# EAGLE design intel-edison-pin-breakout (EAGLE 7.3.0)
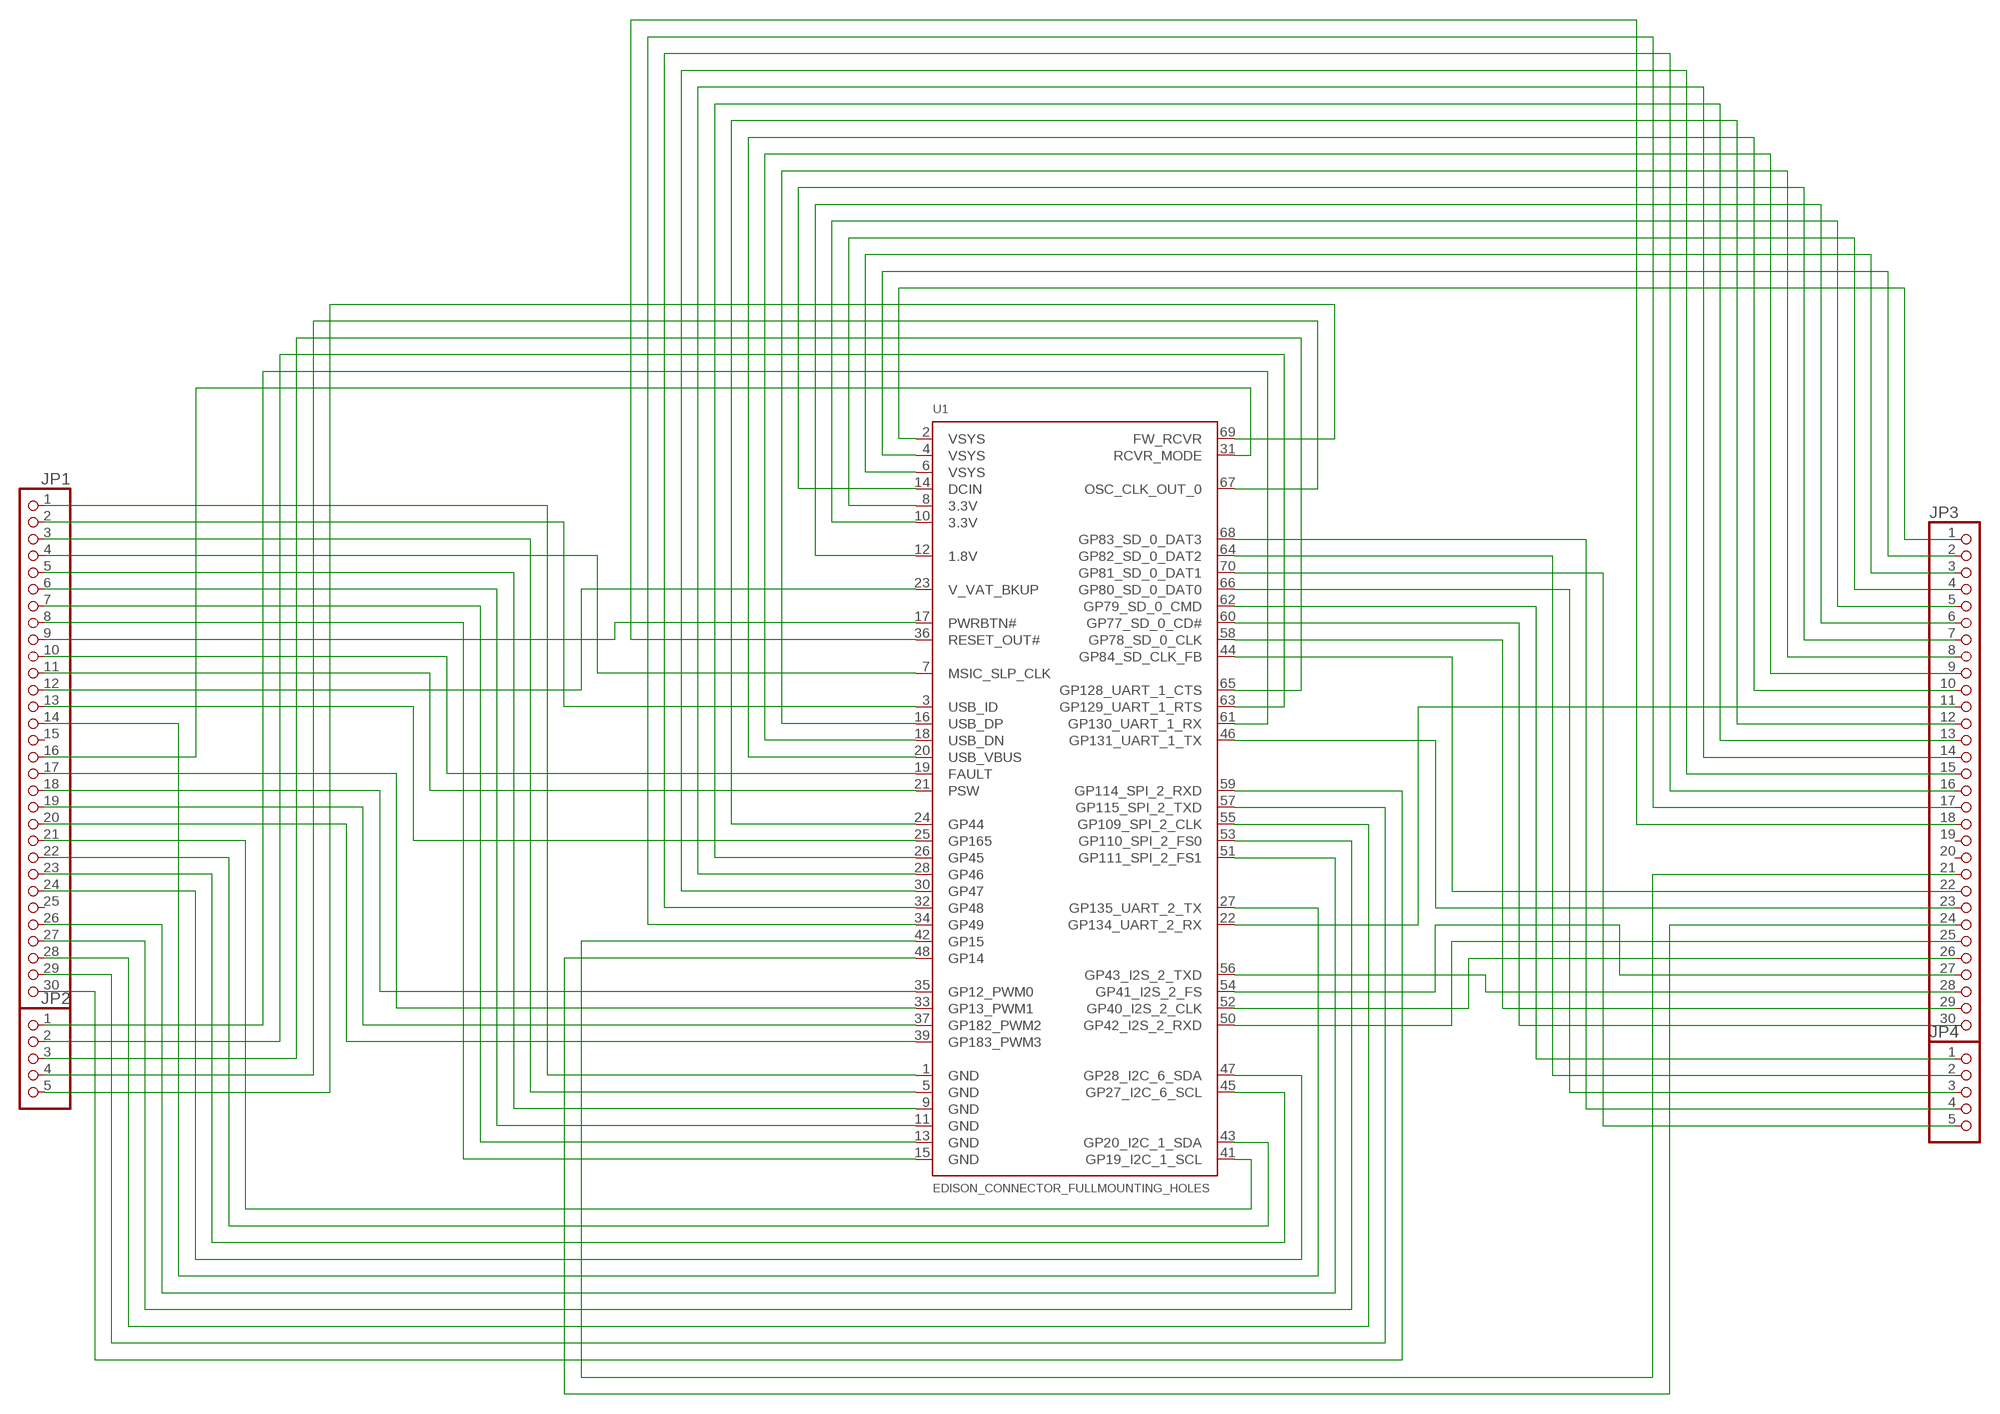
[diagram p0: schematic, sheet 1]

## Parts
JP1  PINHD-1X30  [1X30]
JP2  PINHD-1X5  [1X05]
JP3  PINHD-1X30  [1X30]
JP4  PINHD-1X5  [1X05]
U1  EDISON_CONNECTOR_FULLMOUNTING_HOLES  [EDISON_DAUGHTER]

## Nets
N$1: JP1.1 U1.1(GND)
N$2: JP1.2 U1.3(USB_ID)
N$3: JP1.3 U1.5(GND)
N$4: JP1.4 U1.7(MSIC_SLP_CLK)
N$5: JP1.5 U1.9(GND)
N$6: JP1.6 U1.11(GND)
N$7: JP1.7 U1.13(GND)
N$8: JP1.8 U1.15(GND)
N$9: JP1.9 U1.17(PWRBTN#)
N$10: JP1.10 U1.19(FAULT)
N$11: JP1.11 U1.21(PSW)
N$12: JP1.12 U1.23(V_VAT_BKUP)
N$13: JP1.13 U1.25(GP165)
N$14: JP1.17 U1.33(GP13_PWM1)
N$15: JP1.16 U1.31(RCVR_MODE)
N$16: JP1.18 U1.35(GP12_PWM0)
N$17: JP1.19 U1.37(GP182_PWM2)
N$18: JP1.20 U1.39(GP183_PWM3)
N$19: JP1.21 U1.41(GP19_I2C_1_SCL)
N$20: JP1.22 U1.43(GP20_I2C_1_SDA)
N$21: JP1.23 U1.45(GP27_I2C_6_SCL)
N$22: JP1.24 U1.47(GP28_I2C_6_SDA)
N$23: JP1.26 U1.51(GP111_SPI_2_FS1)
N$24: JP1.27 U1.53(GP110_SPI_2_FS0)
N$25: JP1.28 U1.55(GP109_SPI_2_CLK)
N$26: JP1.29 U1.57(GP115_SPI_2_TXD)
N$27: JP1.30 U1.59(GP114_SPI_2_RXD)
N$28: JP1.14 U1.27(GP135_UART_2_TX)
N$29: JP2.1 U1.61(GP130_UART_1_RX)
N$30: JP2.2 U1.63(GP129_UART_1_RTS)
N$31: JP2.3 U1.65(GP128_UART_1_CTS)
N$32: JP2.4 U1.67(OSC_CLK_OUT_0)
N$33: JP2.5 U1.69(FW_RCVR)
N$34: JP3.1 U1.2(VSYS)
N$35: JP3.2 U1.4(VSYS)
N$36: JP3.3 U1.6(VSYS)
N$37: JP3.4 U1.8(3.3V)
N$38: JP3.5 U1.10(3.3V)
N$39: JP3.6 U1.12(1.8V)
N$40: JP3.7 U1.14(DCIN)
N$41: JP3.8 U1.16(USB_DP)
N$42: JP3.9 U1.18(USB_DN)
N$43: JP3.10 U1.20(USB_VBUS)
N$44: JP3.18 U1.36(RESET_OUT#)
N$45: JP3.12 U1.24(GP44)
N$46: JP3.13 U1.26(GP45)
N$47: JP3.14 U1.28(GP46)
N$48: JP3.15 U1.30(GP47)
N$49: JP3.16 U1.32(GP48)
N$50: JP3.17 U1.34(GP49)
N$51: JP3.11 U1.22(GP134_UART_2_RX)
N$52: JP3.21 U1.42(GP15)
N$53: JP4.5 U1.70(GP81_SD_0_DAT1)
N$54: JP4.4 U1.68(GP83_SD_0_DAT3)
N$55: JP3.24 U1.48(GP14)
N$56: JP4.3 U1.66(GP80_SD_0_DAT0)
N$57: JP4.2 U1.64(GP82_SD_0_DAT2)
N$58: JP4.1 U1.62(GP79_SD_0_CMD)
N$59: JP3.30 U1.60(GP77_SD_0_CD#)
N$60: JP3.29 U1.58(GP78_SD_0_CLK)
N$61: JP3.27 U1.54(GP41_I2S_2_FS)
N$62: JP3.23 U1.46(GP131_UART_1_TX)
N$63: JP3.26 U1.52(GP40_I2S_2_CLK)
N$64: JP3.25 U1.50(GP42_I2S_2_RXD)
N$65: JP3.22 U1.44(GP84_SD_CLK_FB)
N$66: JP3.28 U1.56(GP43_I2S_2_TXD)
Unconnected: JP1.15 JP1.25 JP3.19 JP3.20

## Library data of the parts
JP1 JP3 = pinhead:PINHD-1X30: PIN HEADER
JP2 JP4 = pinhead:PINHD-1X5: PIN HEADER
U1 = Edison:EDISON_CONNECTOR_FULL

## Board
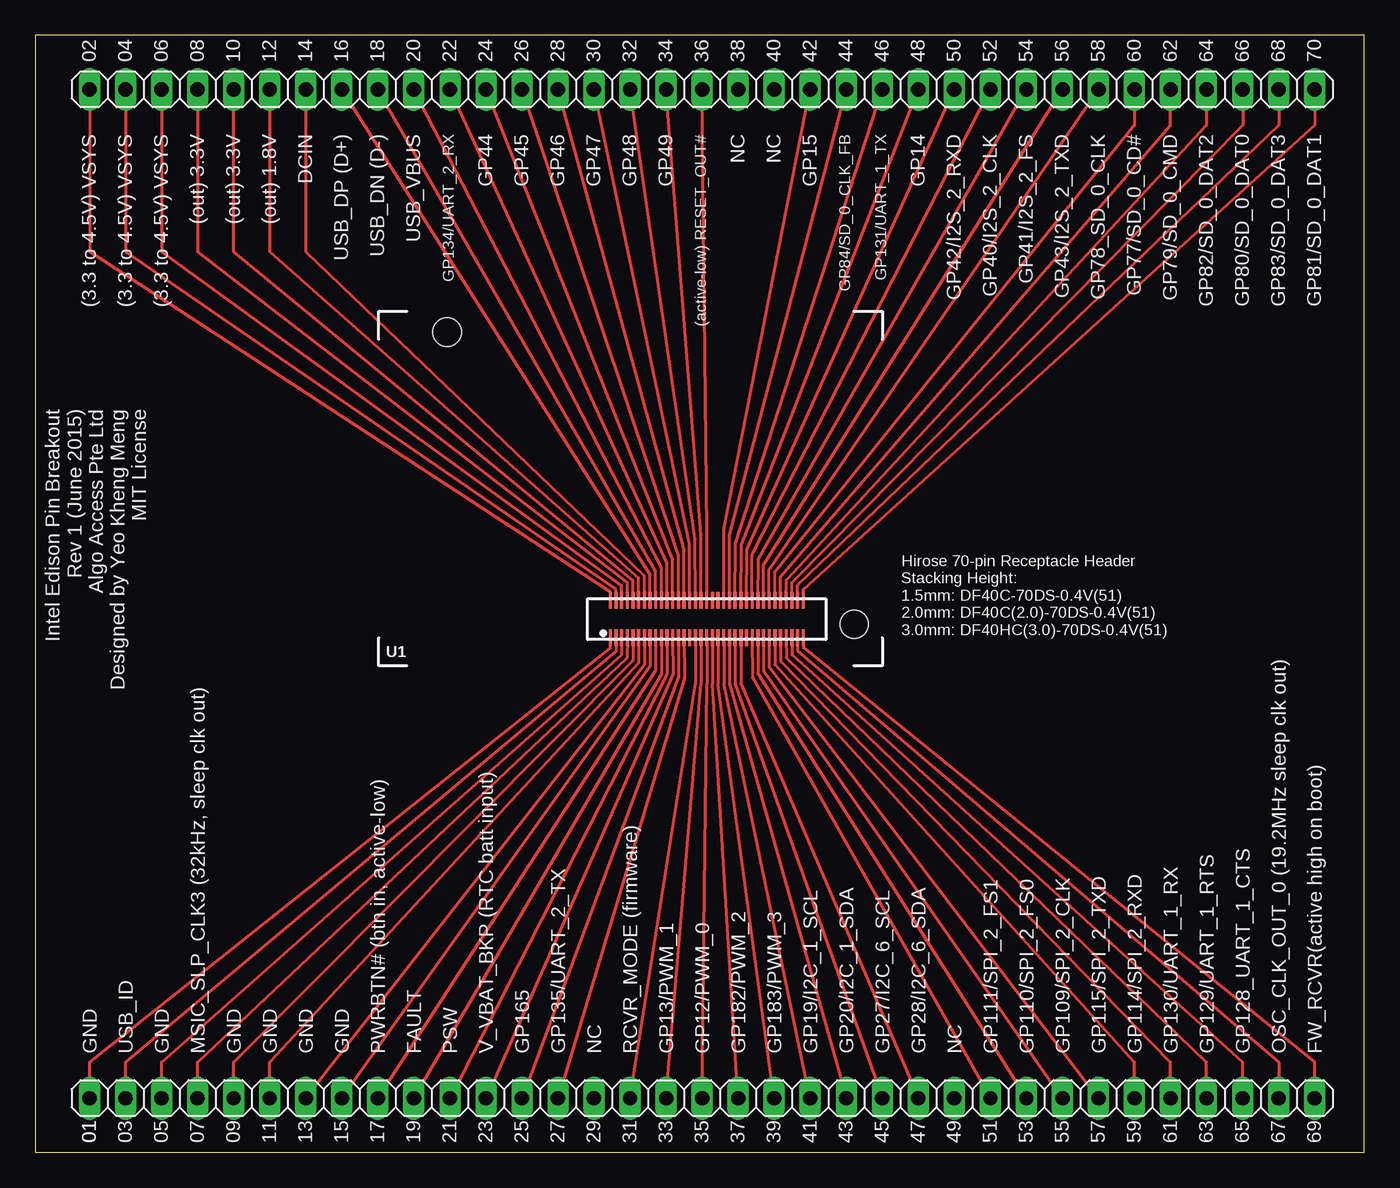
[diagram p1: board, top side]

Size 93.65 x 78.73 mm. Coordinates in mm from the lower left corner, seen from the top.
Outline: 0,0 93.65,0 93.65,78.73 0,78.73 0,0
Copper layers (1*16): Top 0.035mm / dielectric 1.5mm / Bottom 0.035mm
Design rules "SeeedStudio_2layer_DRU_no_angle_20140221": minimum track width 6mil, minimum drill 12mil, track to track 6mil, track to pad 6mil, pad to pad 6mil, via to via 6mil, smd to smd 0mil, copper to edge 10mil, drill to drill 10mil, minimum pad ring 10mil, minimum via ring 6mil, stop-mask expansion 2mil, vias tented up to drill 100mil, thermal gap 10mil

### Footprints (pad centres in the part's own frame; a part is rotated, then mirrored left to right if it is on the bottom)
1X30 = drill 1.016 long: 1 -36.83,0; 2 -34.29,0; 3 -31.75,0; 4 -29.21,0; 5 -26.67,0; 6 -24.13,0; 7 -21.59,0; 8 -19.05,0; 9 -16.51,0; 10 -13.97,0; 11 -11.43,0; 12 -8.89,0; 13 -6.35,0; 14 -3.81,0; 15 -1.27,0; 16 1.27,0; 17 3.81,0; 18 6.35,0; 19 8.89,0; 20 11.43,0; 21 13.97,0; 22 16.51,0; 23 19.05,0; 24 21.59,0; 25 24.13,0; 26 26.67,0; 27 29.21,0; 28 31.75,0; 29 34.29,0; 30 36.83,0
1X05 = drill 1.016 long: 1 -5.08,0; 2 -2.54,0; 3 0,0; 4 2.54,0; 5 5.08,0
EDISON_DAUGHTER = smd 1.14 x 0.2: 1 1.98,19.17; 2 4.62,19.17; 3 1.98,18.77; 4 4.62,18.77; 5 1.98,18.37; 6 4.62,18.37; 7 1.98,17.97; 8 4.62,17.97; 9 1.98,17.57; 10 4.62,17.57; 11 1.98,17.17; 12 4.62,17.17; 13 1.98,16.77; 14 4.62,16.77; 15 1.98,16.37; 16 4.62,16.37; 17 1.98,15.97; 18 4.62,15.97; 19 1.98,15.57; 20 4.62,15.57; 21 1.98,15.17; 22 4.62,15.17; 23 1.98,14.77; 24 4.62,14.77; 25 1.98,14.37; 26 4.62,14.37; 27 1.98,13.97; 28 4.62,13.97; 29 1.98,13.57; 30 4.62,13.57; 31 1.98,13.17; 32 4.62,13.17; 33 1.98,12.77; 34 4.62,12.77; 35 1.98,12.37; 36 4.62,12.37; 37 1.98,11.97; 38 4.62,11.97; 39 1.98,11.57; 40 4.62,11.57; 41 1.98,11.17; 42 4.62,11.17; 43 1.98,10.77; 44 4.62,10.77; 45 1.98,10.37; 46 4.62,10.37; 47 1.98,9.97; 48 4.62,9.97; 49 1.98,9.57; 50 4.62,9.57; 51 1.98,9.17; 52 4.62,9.17; 53 1.98,8.77; 54 4.62,8.77; 55 1.98,8.37; 56 4.62,8.37; 57 1.98,7.97; 58 4.62,7.97; 59 1.98,7.57; 60 4.62,7.57; 61 1.98,7.17; 62 4.62,7.17; 63 1.98,6.77; 64 4.62,6.77; 65 1.98,6.37; 66 4.62,6.37; 67 1.98,5.97; 68 4.62,5.97; 69 1.98,5.57; 70 4.62,5.57 | hole 2: 23.53,30.67; 2.93,1.98

### Placement (x,y rotation side)
JP1  40.64,3.81 0 top
JP2  85.09,3.81 0 top
JP3  40.64,74.93 0 top
JP4  85.09,74.93 0 top
U1  59.69,34.29 90 top

### Tracks (layer width: path | path; a pad name or v marks a point on that pad's centre or on a via)
N$1
  Top 0.203: U1.1 40.52,35.52 3.81,6.35 JP1.1
N$2
  Top 0.203: U1.3 40.92,35.3 6.35,6.35 JP1.2
N$3
  Top 0.203: U1.5 41.32,35.06 8.89,6.35 JP1.3
N$4
  Top 0.203: U1.7 41.71,34.85 11.43,6.35 JP1.4
N$5
  Top 0.203: U1.9 42.11,34.67 13.97,6.35 JP1.5
N$6
  Top 0.203: JP1.6 16.51,6.35 42.5,34.51 U1.11
N$7
  Top 0.203: U1.13 42.93,34.37 JP1.7
N$8
  Top 0.203: U1.15 43.33,34.27 JP1.8
N$9
  Top 0.203: U1.17 43.71,33.96 JP1.9
N$10
  Top 0.203: U1.19 44.12,33.71 JP1.10
N$11
  Top 0.203: U1.21 44.53,33.71 JP1.11
N$12
  Top 0.203: U1.23 44.93,33.71 JP1.12
N$13
  Top 0.203: U1.25 45.31,33.53 JP1.13
N$14
  Top 0.203: U1.33 46.92,33.02 JP1.17
N$15
  Top 0.203: U1.31 46.52,33.02 JP1.16
N$16
  Top 0.203: U1.35 47.32,33.02 JP1.18
N$17
  Top 0.203: U1.37 47.72,33.02 JP1.19
N$18
  Top 0.203: U1.39 48.12,33.02 JP1.20
N$19
  Top 0.203: U1.41 48.52,33.02 JP1.21
N$20
  Top 0.203: U1.43 48.92,33.02 JP1.22
N$21
  Top 0.203: U1.45 49.32,33.02 JP1.23
N$22
  Top 0.203: U1.47 49.72,33.02 JP1.24
N$23
  Top 0.203: U1.51 50.52,33.46 JP1.26
N$24
  Top 0.203: U1.53 50.92,33.74 JP1.27
N$25
  Top 0.203: U1.55 51.32,33.97 JP1.28
N$26
  Top 0.203: U1.57 51.72,34.24 JP1.29
N$27
  Top 0.203: U1.59 52.12,34.37 77.47,6.35 JP1.30
N$28
  Top 0.203: U1.27 45.74,33.45 JP1.14
N$29
  Top 0.203: U1.61 52.52,34.62 80.01,6.35 JP2.1
N$30
  Top 0.203: U1.63 52.92,34.85 82.55,6.35 JP2.2
N$31
  Top 0.203: JP2.3 85.09,6.35 53.32,35.08 U1.65
N$32
  Top 0.203: U1.67 53.72,35.35 87.63,6.35 JP2.4
N$33
  Top 0.203: U1.69 54.12,35.57 90.17,6.35 JP2.5
N$34
  Top 0.203: U1.2 40.52,39.51 3.81,63.5 JP3.1
N$35
  Top 0.203: JP3.2 6.35,63.5 40.92,39.7 U1.4
N$36
  Top 0.203: JP3.3 8.89,63.5 41.32,39.95 U1.6
N$37
  Top 0.203: JP3.4 11.43,63.5 41.73,40.17 U1.8
N$38
  Top 0.203: U1.10 42.12,40.33 13.97,63.5 JP3.5
N$39
  Top 0.203: U1.12 42.52,40.49 16.51,63.5 JP3.6
N$40
  Top 0.203: U1.14 42.92,40.63 19.05,63.5 JP3.7
N$41
  Top 0.203: U1.16 43.33,40.74 JP3.8
N$42
  Top 0.203: U1.18 43.71,40.97 JP3.9
N$43
  Top 0.203: U1.20 44.12,41.22 JP3.10
N$44
  Top 0.203: U1.36 47.32,43.76 JP3.18
N$45
  Top 0.203: U1.24 44.91,41.81 JP3.12
N$46
  Top 0.203: U1.26 45.34,42.06 JP3.13
N$47
  Top 0.203: U1.28 45.72,42.52 JP3.14
N$48
  Top 0.203: U1.30 46.1,42.88 JP3.15
N$49
  Top 0.203: U1.32 46.51,43.26 JP3.16
N$50
  Top 0.203: U1.34 46.91,43.51 JP3.17
N$51
  Top 0.203: U1.22 44.53,41.53 JP3.11
N$52
  Top 0.203: U1.42 48.54,43.97 JP3.21
N$53
  Top 0.203: U1.70 54.12,39.67 54.13,39.67 90.17,72.39 JP4.5
N$54
  Top 0.203: U1.68 53.72,39.98 87.63,72.39 JP4.4
N$55
  Top 0.203: U1.48 49.76,42.8 JP3.24
N$56
  Top 0.203: U1.66 53.31,40.16 85.09,72.39 JP4.3
N$57
  Top 0.203: U1.64 52.93,40.36 82.55,72.39 JP4.2
N$58
  Top 0.203: U1.62 52.53,40.59 80.01,72.39 JP4.1
N$59
  Top 0.203: U1.60 52.12,40.92 77.47,72.39 JP3.30
N$60
  Top 0.203: U1.58 51.71,41.1 JP3.29
N$61
  Top 0.203: U1.54 50.95,41.83 JP3.27
N$62
  Top 0.203: U1.46 49.33,42.93 JP3.23
N$63
  Top 0.203: U1.52 50.49,42.09 JP3.26
N$64
  Top 0.203: U1.50 50.14,42.49 JP3.25
N$65
  Top 0.203: U1.44 48.92,43.48 JP3.22
N$66
  Top 0.203: U1.56 51.31,41.4 JP3.28

### Text on the board
tPlace: 02 | 04 | 06 | 08 | 10 | 12 | 14 | 16 | 18 | 20 | 22 | 24 | 26 | 28 | 30 | 32 | 34 | 36 | 38 | 40 | 42 | 44 | 46 | 48 | 50 | 52 | 54 | 56 | 58 | 60 | 62 | 64 | 66 | 68 | 70 | (3.3 to 4.5V) VSYS | (3.3 to 4.5V) VSYS | (3.3 to 4.5V) VSYS | (out) 3.3V | (out) 3.3V | (out) 1.8V | DCIN | USB_DP (D+) | USB_DN (D-) | USB_VBUS | GP134/UART_2_RX | GP44 | GP45 | GP46 | GP47 | GP48 | GP49 | (active-low) RESET_OUT# | NC | NC | GP15 | GP84/SD_0_CLK_FB | GP131/UART_1_TX | GP14 | GP42/I2S_2_RXD | GP40/I2S_2_CLK | GP41/I2S_2_FS | GP43/I2S_2_TXD | GP78_SD_0_CLK | GP77/SD_0_CD# | GP79/SD_0_CMD | GP82/SD_0_DAT2 | GP80/SD_0_DAT0 | GP83/SD_0_DAT3 | GP81/SD_0_DAT1 | Intel Edison Pin Breakout / Rev 1 (June 2015) / Algo Access Pte Ltd / Designed by Yeo Kheng Meng / MIT License | Hirose 70-pin Receptacle Header / Stacking Height: / 1.5mm: DF40C-70DS-0.4V(51) / 2.0mm: DF40C(2.0)-70DS-0.4V(51) / 3.0mm: DF40HC(3.0)-70DS-0.4V(51) | GND | USB_ID | GND | MSIC_SLP_CLK3 (32kHz, sleep clk out) | GND | GND | GND | GND | PWRBTN# (btn in, active-low) | FAULT | PSW | V_VBAT_BKP (RTC batt input) | GP165 | GP135/UART_2_TX | NC | RCVR_MODE (firmware) | GP13/PWM_1 | GP12/PWM_0 | GP182/PWM_2 | GP183/PWM_3 | GP19/I2C_1_SCL | GP20/I2C_1_SDA | GP27/I2C_6_SCL | GP28/I2C_6_SDA | NC | GP111/SPI_2_FS1 | GP110/SPI_2_FS0 | GP109/SPI_2_CLK | GP115/SPI_2_TXD | GP114/SPI_2_RXD | GP130/UART_1_RX | GP129/UART_1_RTS | GP128_UART_1_CTS | OSC_CLK_OUT_0 (19.2MHz sleep clk out) | FW_RCVR(active high on boot) | 01 | 01 | 03 | 05 | 07 | 09 | 11 | 13 | 15 | 17 | 19 | 21 | 23 | 25 | 27 | 29 | 31 | 33 | 35 | 37 | 39 | 41 | 43 | 45 | 47 | 49 | 51 | 53 | 55 | 57 | 59 | 61 | 63 | 65 | 67 | 69